# EAGLE schematic lightMiner (EAGLE 9.5.2)

## Sheet 1 of 3: Pi Zero, EEPROMs & LoRa
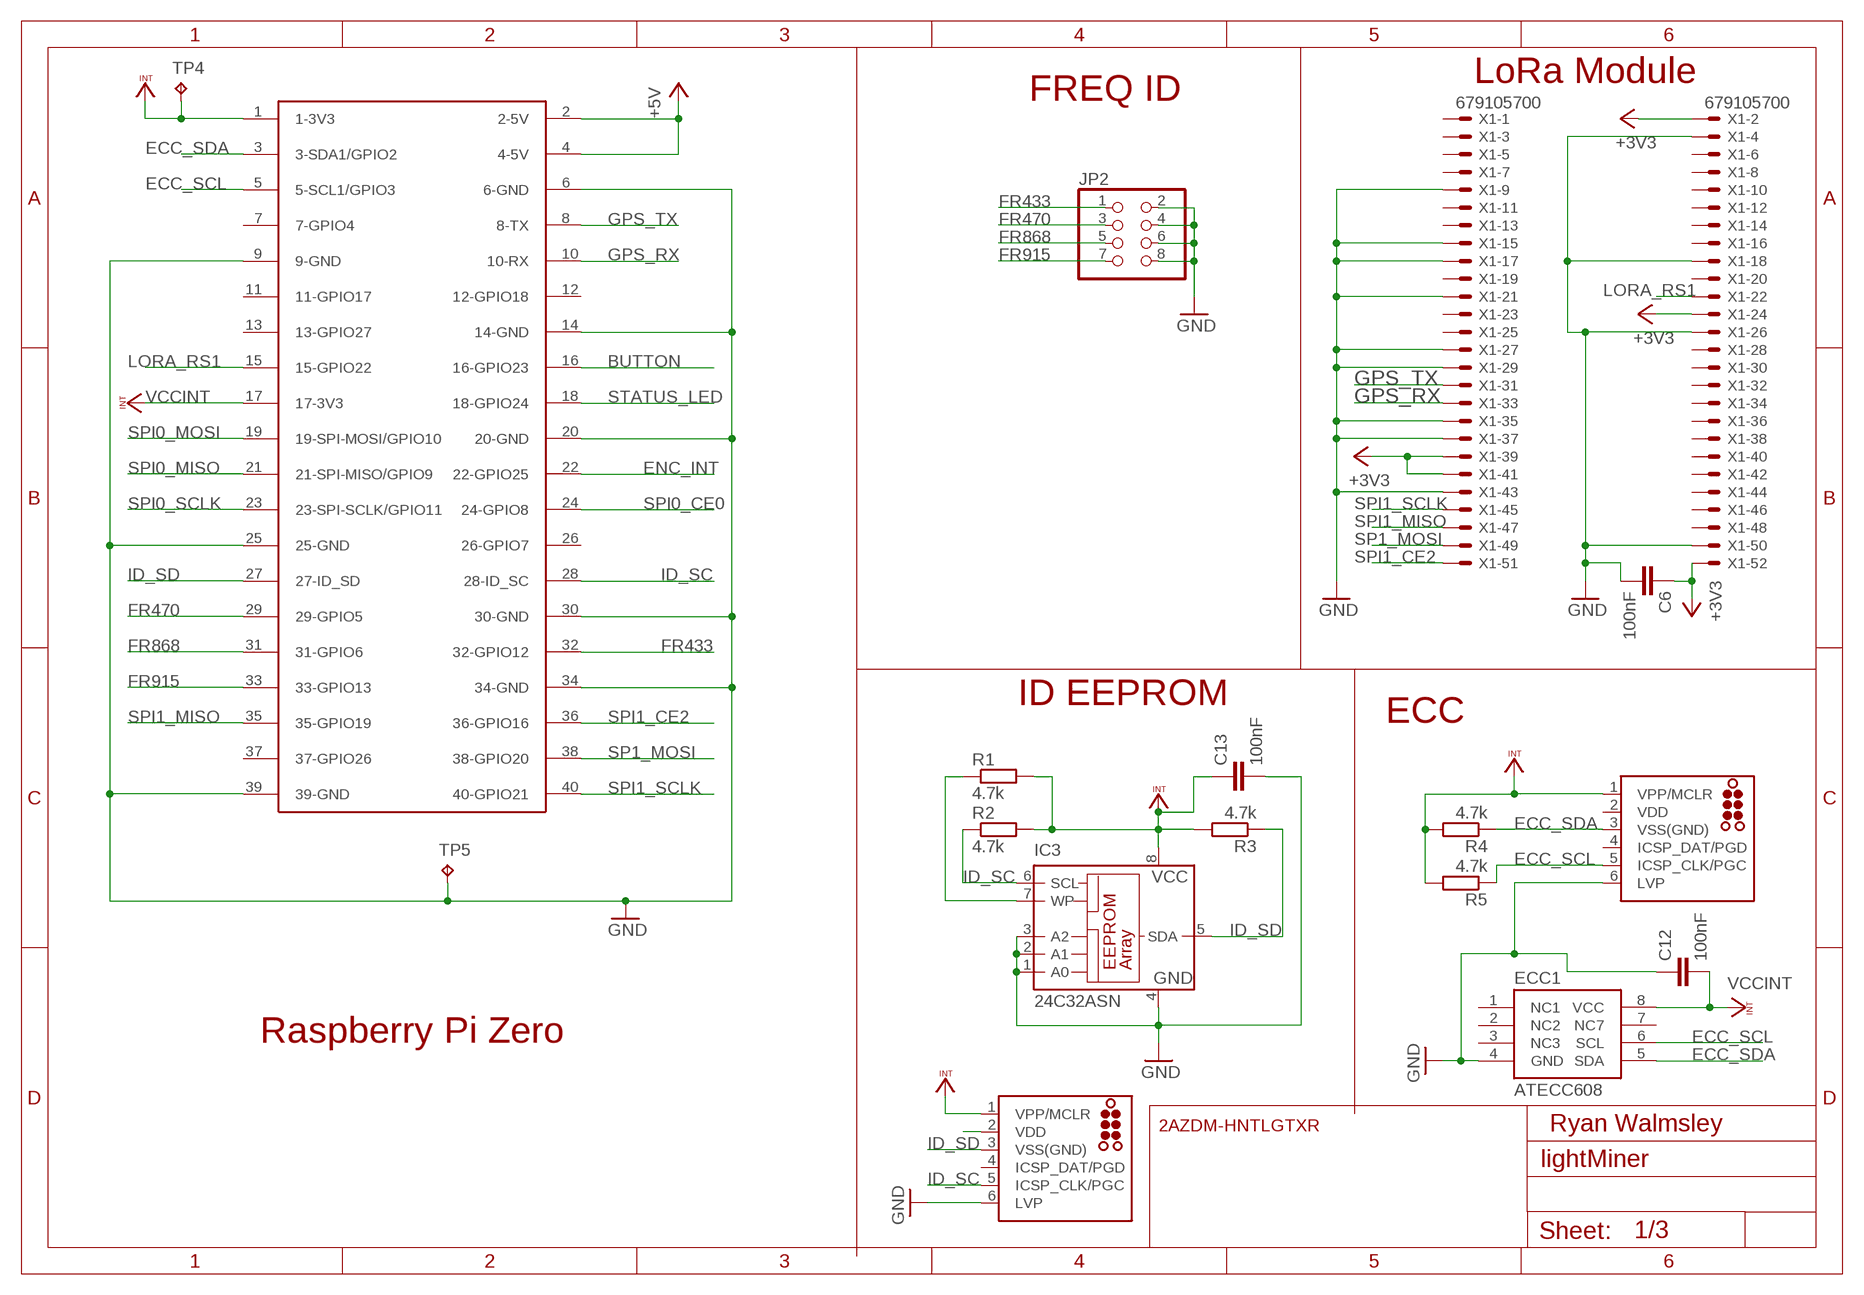
[diagram p0: schematic, sheet 1]

### Parts
C6  100nF  C-EUC0603  [C0603]
C12  100nF  C-EUC0603  [C0603]
C13  100nF  C-EUC0603  [C0603]
ECC1  ATECC608  ATECC108  [SO08]
IC3  24C32ASN  [SO-08]
J1  TC2030-MCP-NL  [TC2030-MCP-NL]
J3  TC2030-MCP-NL  [TC2030-MCP-NL]
JP2  PINHD-2X4  [2X04]
R1  4.7k  R-EU_R0603  [R0603]
R2  4.7k  R-EU_R0603  [R0603]
R3  4.7k  R-EU_R0603  [R0603]
R4  4.7k  R-EU_R0603  [R0603]
R5  4.7k  R-EU_R0603  [R0603]
TP4  TPPAD1-13  [P1-13]
TP5  TPPAD1-13  [P1-13]
U$1  RASPBERRY-PI+PIZERO  [RASPBERRY-PI-ZERO]
X1  679105700  [679105700]

### Nets
+3V3: C6.1 X1.2 X1.24 X1.39 X1.41 X1.52 ; also sheet 2,3
+5V: U$1.2(2-5V) U$1.4(4-5V) ; also sheet 2,3
BUTTON: U$1.16(16-GPIO23) ; also sheet 2
ECC_SCL: ECC1.6(SCL) J1.5(ICSP_CLK/PGC) R5.1 U$1.5(5-SCL1/GPIO3)
ECC_SDA: ECC1.5(SDA) J1.3(VSS(GND)) R4.1 U$1.3(3-SDA1/GPIO2)
ENC_INT: U$1.22(22-GPIO25) ; also sheet 3
FR433: JP2.1 U$1.32(32-GPIO12)
FR470: JP2.3 U$1.29(29-GPIO5)
FR868: JP2.5 U$1.31(31-GPIO6)
FR915: JP2.7 U$1.33(33-GPIO13)
GND: C6.2 C12.1 C13.2 ECC1.4(GND) IC3.1(A0) IC3.2(A1) IC3.3(A2) IC3.4(GND) J1.6(LVP) J3.6(LVP) JP2.2 JP2.4 JP2.6 JP2.8 TP5.TP U$1.6(6-GND) U$1.9(9-GND) U$1.14(14-GND) U$1.20(20-GND) U$1.25(25-GND) U$1.30(30-GND) U$1.34(34-GND) U$1.39(39-GND) X1.4 X1.9 X1.15 X1.17 X1.18 X1.21 X1.26 X1.27 X1.29 X1.35 X1.37 X1.43 X1.50 ; also sheet 2,3
GPS_RX: U$1.10(10-RX) X1.33
GPS_TX: U$1.8(8-TX) X1.31
ID_SC: IC3.6(SCL) J3.5(ICSP_CLK/PGC) R2.1 U$1.28(28-ID_SC)
ID_SD: IC3.5(SDA) J3.3(VSS(GND)) R3.1 U$1.27(27-ID_SD)
LORA_RS1: U$1.15(15-GPIO22) X1.22
N$4: J3.2(VDD)
N$5: IC3.7(WP) R1.1
SP1_MOSI: U$1.38(38-GPIO20) X1.49
SPI0_CE0: U$1.24(24-GPIO8) ; also sheet 3
SPI0_MISO: U$1.21(21-SPI-MISO/GPIO9) ; also sheet 3
SPI0_MOSI: U$1.19(19-SPI-MOSI/GPIO10) ; also sheet 3
SPI0_SCLK: U$1.23(23-SPI-SCLK/GPIO11) ; also sheet 3
SPI1_CE2: U$1.36(36-GPIO16) X1.51
SPI1_MISO: U$1.35(35-GPIO19) X1.47
SPI1_SCLK: U$1.40(40-GPIO21) X1.45
STATUS_LED: U$1.18(18-GPIO24) ; also sheet 2
VCCINT: C12.2 C13.1 ECC1.8(VCC) IC3.8(VCC) J1.1(VPP/MCLR) J3.1(VPP/MCLR) R1.2 R2.2 R3.2 R4.2 R5.2 TP4.TP U$1.1(1-3V3) U$1.17(17-3V3)
Unconnected: ECC1.1(NC1) ECC1.2(NC2) ECC1.3(NC3) ECC1.7(NC7) J1.4(ICSP_DAT/PGD) J3.4(ICSP_DAT/PGD) U$1.7(7-GPIO4) U$1.11(11-GPIO17) U$1.12(12-GPIO18) U$1.13(13-GPIO27) U$1.26(26-GPIO7) U$1.37(37-GPIO26) X1.1 X1.3 X1.5 X1.6 X1.7 X1.8 X1.10 X1.11 X1.12 X1.13 X1.14 X1.16 X1.19 X1.20 X1.23 X1.25 X1.28 X1.30 X1.32 X1.34 X1.36 X1.38 X1.40 X1.42 X1.44 X1.46 X1.48

### Notes on the sheet
- LoRa Module
- FREQ ID
- ID EEPROM
- ECC
- Raspberry Pi Zero
- 2AZDM-HNTLGTXR | Ryan Walmsley

## Sheet 2 of 3: Power & Interfaces
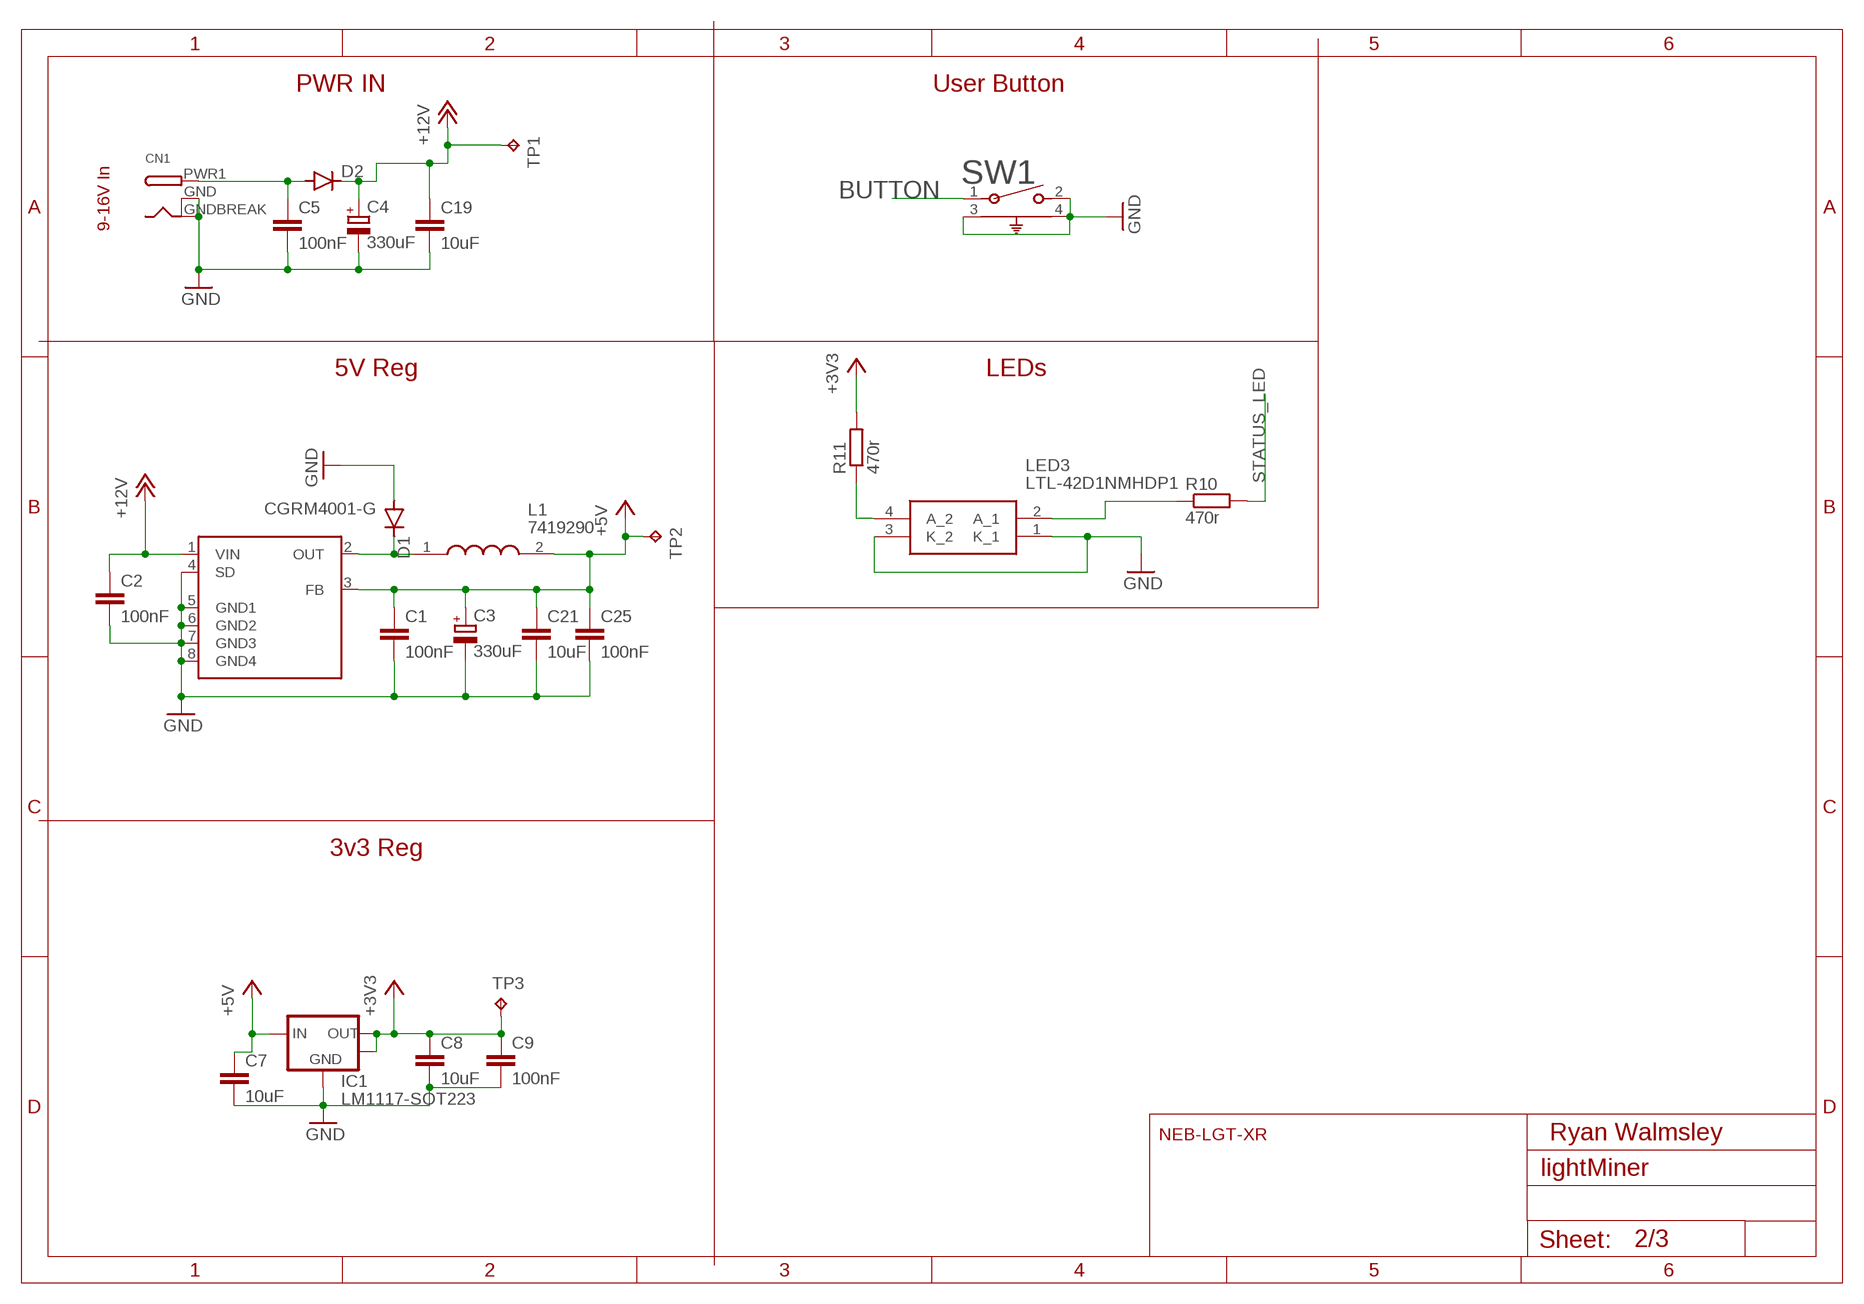
[diagram p1: schematic, sheet 2]

### Parts
C1  100nF  C-EUC0603  [C0603]
C2  100nF  C-EUC0603  [C0603]
C3  330uF  CPOL-EUE5-10.5  [E5-10,5]
C4  330uF  CPOL-EUE5-10.5  [E5-10,5]
C5  100nF  C-EUC0603  [C0603]
C7  10uF  C-EUC0805  [C0805]
C8  10uF  C-EUC0805  [C0805]
C9  100nF  C-EUC0603  [C0603]
C19  10uF  C-EUC0805  [C0805]
C21  10uF  C-EUC0805  [C0805]
C25  100nF  C-EUC0603  [C0603]
CN1  DCBARRELSMT  [DCJACK_2MM_SMT]
D1  CGRM4001-G  [SOD-123_MINI-SMA]
D2  DIODE-SMB  [SMB]
IC1  LM1117-SOT223  [SOT-223-3]
L1  7419290  [INDPM115100X410N]
LED3  LTL-42D1NMHDP1  [LTL42D1NMHDP1]
R10  470r  R-EU_R0603  [R0603]
R11  470r  R-EU_R0603  [R0603]
SW1  1825027-8  [SW2_1825027-C_TEC]
TP1  TPPAD1-13  [P1-13]
TP2  TPPAD1-13  [P1-13]
TP3  TPPAD1-13  [P1-13]
U1  AP1509  [SO08]

### Nets
+3V3: C8.1 C9.1 IC1.2(VOUT) IC1.4(HEATSINK) R11.2 TP3.TP ; also sheet 1,3
+5V: C1.1 C3.+ C7.1 C21.1 C25.1 IC1.3(VIN) L1.2 TP2.TP U1.3(FB) ; also sheet 1,3
+12V: C2.1 C4.+ C19.1 D2.C TP1.TP U1.1(VIN)
BUTTON: SW1.1 ; also sheet 1
GND: C1.2 C2.2 C3.- C4.- C5.2 C7.2 C8.2 C9.2 C19.2 C21.2 C25.2 CN1.GND(GNDBREAK) CN1.GNDBREAK(GND) D1.A IC1.1(GND) LED3.1(K_1) LED3.3(K_2) SW1.2 SW1.3 SW1.4 U1.4(SD) U1.5(GND1) U1.6(GND2) U1.7(GND3) U1.8(GND4) ; also sheet 1,3
N$1: C5.1 CN1.PWR1(PWR) D2.A
N$6: LED3.4(A_2) R11.1
N$8: LED3.2(A_1) R10.1
N$10: D1.C L1.1 U1.2(OUT)
STATUS_LED: R10.2 ; also sheet 1

### Notes on the sheet
- PWR IN | User Button
- 9-16V In
- 5V Reg | LEDs
- 3v3 Reg
- NEB-LGT-XR | Ryan Walmsley

## Sheet 3 of 3: Networking
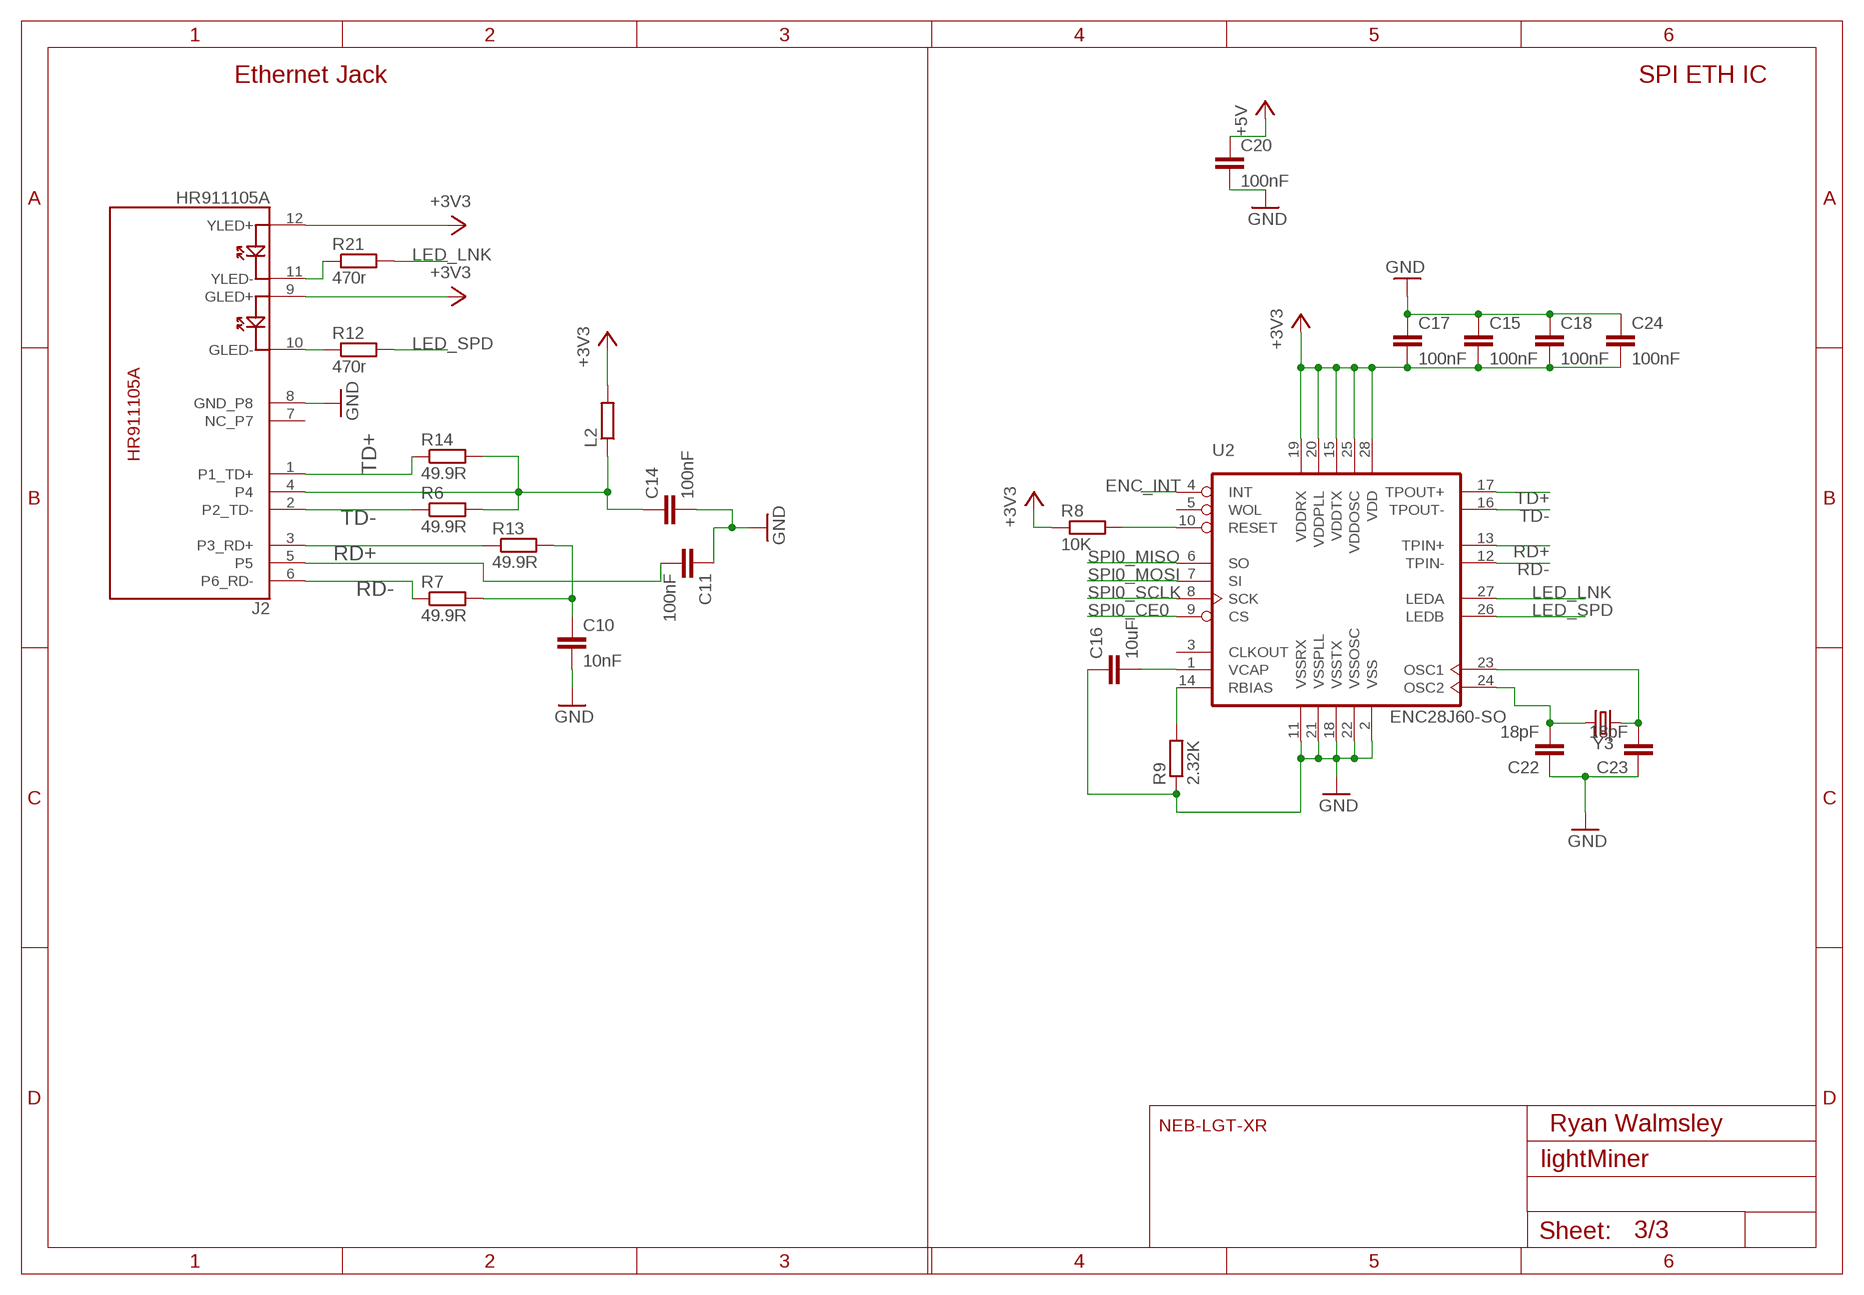
[diagram p2: schematic, sheet 3]

### Parts
C10  10nF  C-EUC0603  [C0603]
C11  100nF  C-EUC0603  [C0603]
C14  100nF  C-EUC0603  [C0603]
C15  100nF  C-EUC0603  [C0603]
C16  10uF  C-EUC0805  [C0805]
C17  100nF  C-EUC0603  [C0603]
C18  100nF  C-EUC0603  [C0603]
C20  100nF  C-EUC0603  [C0603]
C22  18pF  C-EUC0603  [C0603]
C23  18pF  C-EUC0603  [C0603]
C24  100nF  C-EUC0603  [C0603]
J2  HR911105A  [HR911105A]
L2  R-EU_R0603  [R0603]
R6  49.9R  R-EU_R0603  [R0603]
R7  49.9R  R-EU_R0603  [R0603]
R8  10K  R-EU_R0603  [R0603]
R9  2.32K  R-EU_R0603  [R0603]
R12  470r  R-EU_R0603  [R0603]
R13  49.9R  R-EU_R0603  [R0603]
R14  49.9R  R-EU_R0603  [R0603]
R21  470r  R-EU_R0603  [R0603]
U2  ENC28J60-SO  [SO28W]
Y3  25Mhz  CRYSTALSMD-HC49UP  [HC49UP]

### Nets
+3V3: C15.2 C17.2 C18.2 C24.2 J2.9(GLED+) J2.12(YLED+) L2.2 R8.1 U2.15(VDDTX) U2.19(VDDRX) U2.20(VDDPLL) U2.25(VDDOSC) U2.28(VDD) ; also sheet 1,2
+5V: C20.1 ; also sheet 1,2
ENC_INT: U2.4(INT) ; also sheet 1
GND: C10.2 C11.1 C14.2 C15.1 C16.1 C17.1 C18.1 C20.2 C22.1 C23.1 C24.1 J2.8(GND_P8) R9.1 U2.2(VSS) U2.11(VSSRX) U2.18(VSSTX) U2.21(VSSPLL) U2.22(VSSOSC) ; also sheet 1,2
LED_LNK: R21.2 U2.27(LEDA)
LED_SPD: R12.2 U2.26(LEDB)
N$2: J2.11(YLED-) R21.1
N$3: C10.1 R7.2 R13.2
N$7: J2.10(GLED-) R12.1
N$9: C16.2 U2.1(VCAP)
N$11: C11.2 J2.5
N$12: C22.2 U2.24(OSC2) Y3.2
N$13: C14.1 J2.4 L2.1 R6.2 R14.2
N$18: R8.2 U2.10(RESET)
N$19: R9.2 U2.14(RBIAS)
N$37: C23.2 U2.23(OSC1) Y3.1
RD+: J2.3(P3_RD+) R13.1 U2.13(TPIN+)
RD-: J2.6(P6_RD-) R7.1 U2.12(TPIN-)
SPI0_CE0: U2.9(CS) ; also sheet 1
SPI0_MISO: U2.6(SO) ; also sheet 1
SPI0_MOSI: U2.7(SI) ; also sheet 1
SPI0_SCLK: U2.8(SCK) ; also sheet 1
TD+: J2.1(P1_TD+) R14.1 U2.17(TPOUT+)
TD-: J2.2(P2_TD-) R6.1 U2.16(TPOUT-)
Unconnected: J2.7(NC_P7) U2.3(CLKOUT) U2.5(WOL)

### Notes on the sheet
- Ethernet Jack | SPI ETH IC
- NEB-LGT-XR | Ryan Walmsley

## Power pins joined to a net without a drawn wire
VDD: J1.2(VDD)

## Library data of the parts
C1 C2 C5-C25 = resistor:C-EU: CAPACITOR, European symbol
C3 C4 = resistor:CPOL-EU: POLARIZED CAPACITOR, European symbol
CN1 = adafruit:DCBARREL: 2.0mm DC Barrel Jack DCJACK_2MM_PTH - Through Hole Jack (4UConnector: 05537)
D1 = diode:CGRM400*-G: Molded plasitc,JEDEC SOD-123/Mini SMA Source: Comchip CGRM4001-G.pdf
D2 = diode:DIODE-: DIODE
ECC1 = SparkFun-IC-Special-Function:ATECC108: ATECC108 ECDSA with NIST ATECC108: Provides ECDSA with NIST curves P256, B283, and K283. Also, a RNG, 8.5Kb EEPROM. 2.0V - 5.5V. Datasheet <https://cdn.sparkfun.com/datasheets/Dev/Beagle/Atmel-8873S-CryptoAuth-ATECC108-Datasheet-Summary.pdf> SparkFun Products CryptoCape <https://www.sparkfun.com/products/12773> (DEV-12773) SparkFun CryptoShield <https://www.sparkfun.com/products/13183> (DEV-13183); PROD_ID: IC-11982; VALUE: ATECC108
IC1 = bt_regulator:LM1117: LDO Voltage Regulator NCP1117 series are low dropout positive voltage regulators that are capable of providing an output current that is in excess of 1.0 A with a maximum dropout voltage of 1.2 V at 800 mA over temperature. This series contains nine fixed output voltages of 1.5 V, 1.8 V, 1.9 V, 2.0 V, 2.5 V, 2.85 V, 3.3 V, 5.0 V, and 12 V that have no minimum load requirement to maintain regulation. Also included is an adjustable output version that can be programmed from 1.25 V to 18.8 V with two external resistors. datasheet.pdf <http://www.onsemi.com/pub_link/Collateral/NCP1117-D.PDF> LM1117-N is a series of low dropout voltage regulators of 1.2V at 800mA of load current. It has the same pin-out as Texas Instruments' industry standard LM317. The LM1117-N is available in an adjustable version, available in five fixed voltages, 1.8V, 2.5V, 2.85V, 3.3V, and 5V. The LM1117-N offers current limiting and thermal shutdown. Its circuit includes a zener trimmed to within ±1%. datasheet.pdf <http://www.ti.com/lit/ds/symlink/lm1117-n.pdf>
IC3 = microchip:24*: Serial EEPROM I2C; MPN: IS24C32A-2GLI; OC_FARNELL: 1224413; OC_NEWARK: 43M4588
J1 J3 = tag-connect:TC2030: TAG-CONNECT ICSP Connector Manufacturer: Tag-Connect <http://www.tag-connect.com> Cable for easy In-Circuit Serial Programming. Designed for Microchip ICD2, suitable for many others. Two variants - one "with legs" (for hands-free fit on PCB) and another "without legs" for quick programming. PAD Description 1 MCLR/Vpp 2 Vdd 3 GND 4 PGD (ISPDAT) 5 PGC (ISPCLK) 6 nc (used for LVP) ©2009 ROFA.cz - modified and updated by Robert Darlington ‹rdarlington@gmail.com›
J2 = DECADE-libraries20151104:HR911105A: RJ-45 with LEDs
JP2 = pinhead:PINHD-2X4: PIN HEADER
L1 = SamacSys_Parts:7419290: RS Pro NPIS104F Series Shielded Wire-wound SMD Inductor 47 H 20% 1.9A Idc Source: Datasheet <http://docs-europe.electrocomponents.com/webdocs/1581/0900766b81581d01.pdf>; DESCRIPTION: RS Pro NPIS104F Series Shielded Wire-wound SMD Inductor 47 H 20% 1.9A Idc; HEIGHT: 4.1mm; MANUFACTURER_NAME: RS Components; MANUFACTURER_PART_NUMBER: 7419290; RS_PART_NUMBER: 7419290
L2 R1-R14 R21 = resistor:R-EU_: RESISTOR, European symbol
LED3 = LTL-42D1NMHDP1:LTL-42D1NMHDP1: LED Circuit Board Indicators Housing LED ThruHole 3mm 2Lvl Grn/Yellow Source: Datasheet <https://datasheet.datasheetarchive.com/originals/distributors/Datasheets-305/79387.pdf>; ARROW_PART_NUMBER: LTL-42D1NMHDP1; ARROW_PRICE-STOCK: https://www.arrow.com/en/products/ltl-42d1nmhdp1/lite-on-technology; DESCRIPTION: LED Circuit Board Indicators Housing LED ThruHole 3mm 2Lvl Grn/Yellow; HEIGHT: 9.6mm; MANUFACTURER_NAME: Lite-On; MANUFACTURER_PART_NUMBER: LTL-42D1NMHDP1; MOUSER_PART_NUMBER: 859-LTL-42D1NMHDP1; MOUSER_PRICE-STOCK: https://www.mouser.co.uk/ProductDetail/Lite-On/LTL-42D1NMHDP1?qs=WxFF5lh7QM1L2xMrizlF%2FQ%3D%3D
SW1 = ryanteck:1825027-8; BUILT_BY: EMA_UL_Team; CONFIGURATION__POLE-THROW_: Single Pole - Single Throw; COPYRIGHT: Copyright (C) 2016 Accelerated Designs. All rights reserved; DESCRIPTION: FSMRA3JH04=R/A,TACT PB SW,160G; MANUFACTURER_PART_NUMBER: 1825027-8; MAX_SWITCHING_CURRENT: -; MAX_SWITCHING_VOLTAGE_AC_: -; PRODUCT_TYPE: Switch; SOURCELIBRARY: TE_Connectivity-2018-03-16; SWITCH_TYPE: Tactile Switches; TE_PART_NUMBER: 1825027-8; VENDOR: TE Connectivity
TP1-TP5 = testpad:TP: Test pad
U1 = bt_regulator:AP1509: AP1509, 150KHz, 2A PWM BUCK DC/DC CONVERTER The AP1509 series are monolithic IC designed for a stepdown DC/DC converter, and own the ability of driving a 2A load without additional transistor. Datasheet.pdf <http://www.diodes.com/_files/datasheets/AP1509.pdf>
U2 = microchip-enc28j60:ENC28J60-*: Microchip 10Mbit Eth. contoller with SPI interface
U$1 = Ava:RASPBERRY-PI+: Samtec SSW-120-01-T-D
X1 = con-molex-3:679105700: MINI PCI EXPRESS CONNECTOR 0.8MM PITCH, 52 CIRCUIT Source: http://www.molex.com/pdm_docs/sd/679105700_sd.pdf; MPN: 67910-5700; OC_FARNELL: unknown; OC_NEWARK: 93M2128
Y3 = SparkFun-Clocks:CRYSTAL: Crystals (Generic) These are passive quartz crystals, which can be used as a clock source for a microcontroller. Crystal's are two-terminal devices. They require external "load" capacitors to generate an oscillating signal.